# Altium schematic sheet MCU.SchDoc
size A2; SheetNumber: 3; SheetTotal: 9; SPICEModelCacheXJMQHWHR: <root> / <DocumentId>XJMQHWHR</DocumentId> / </root>
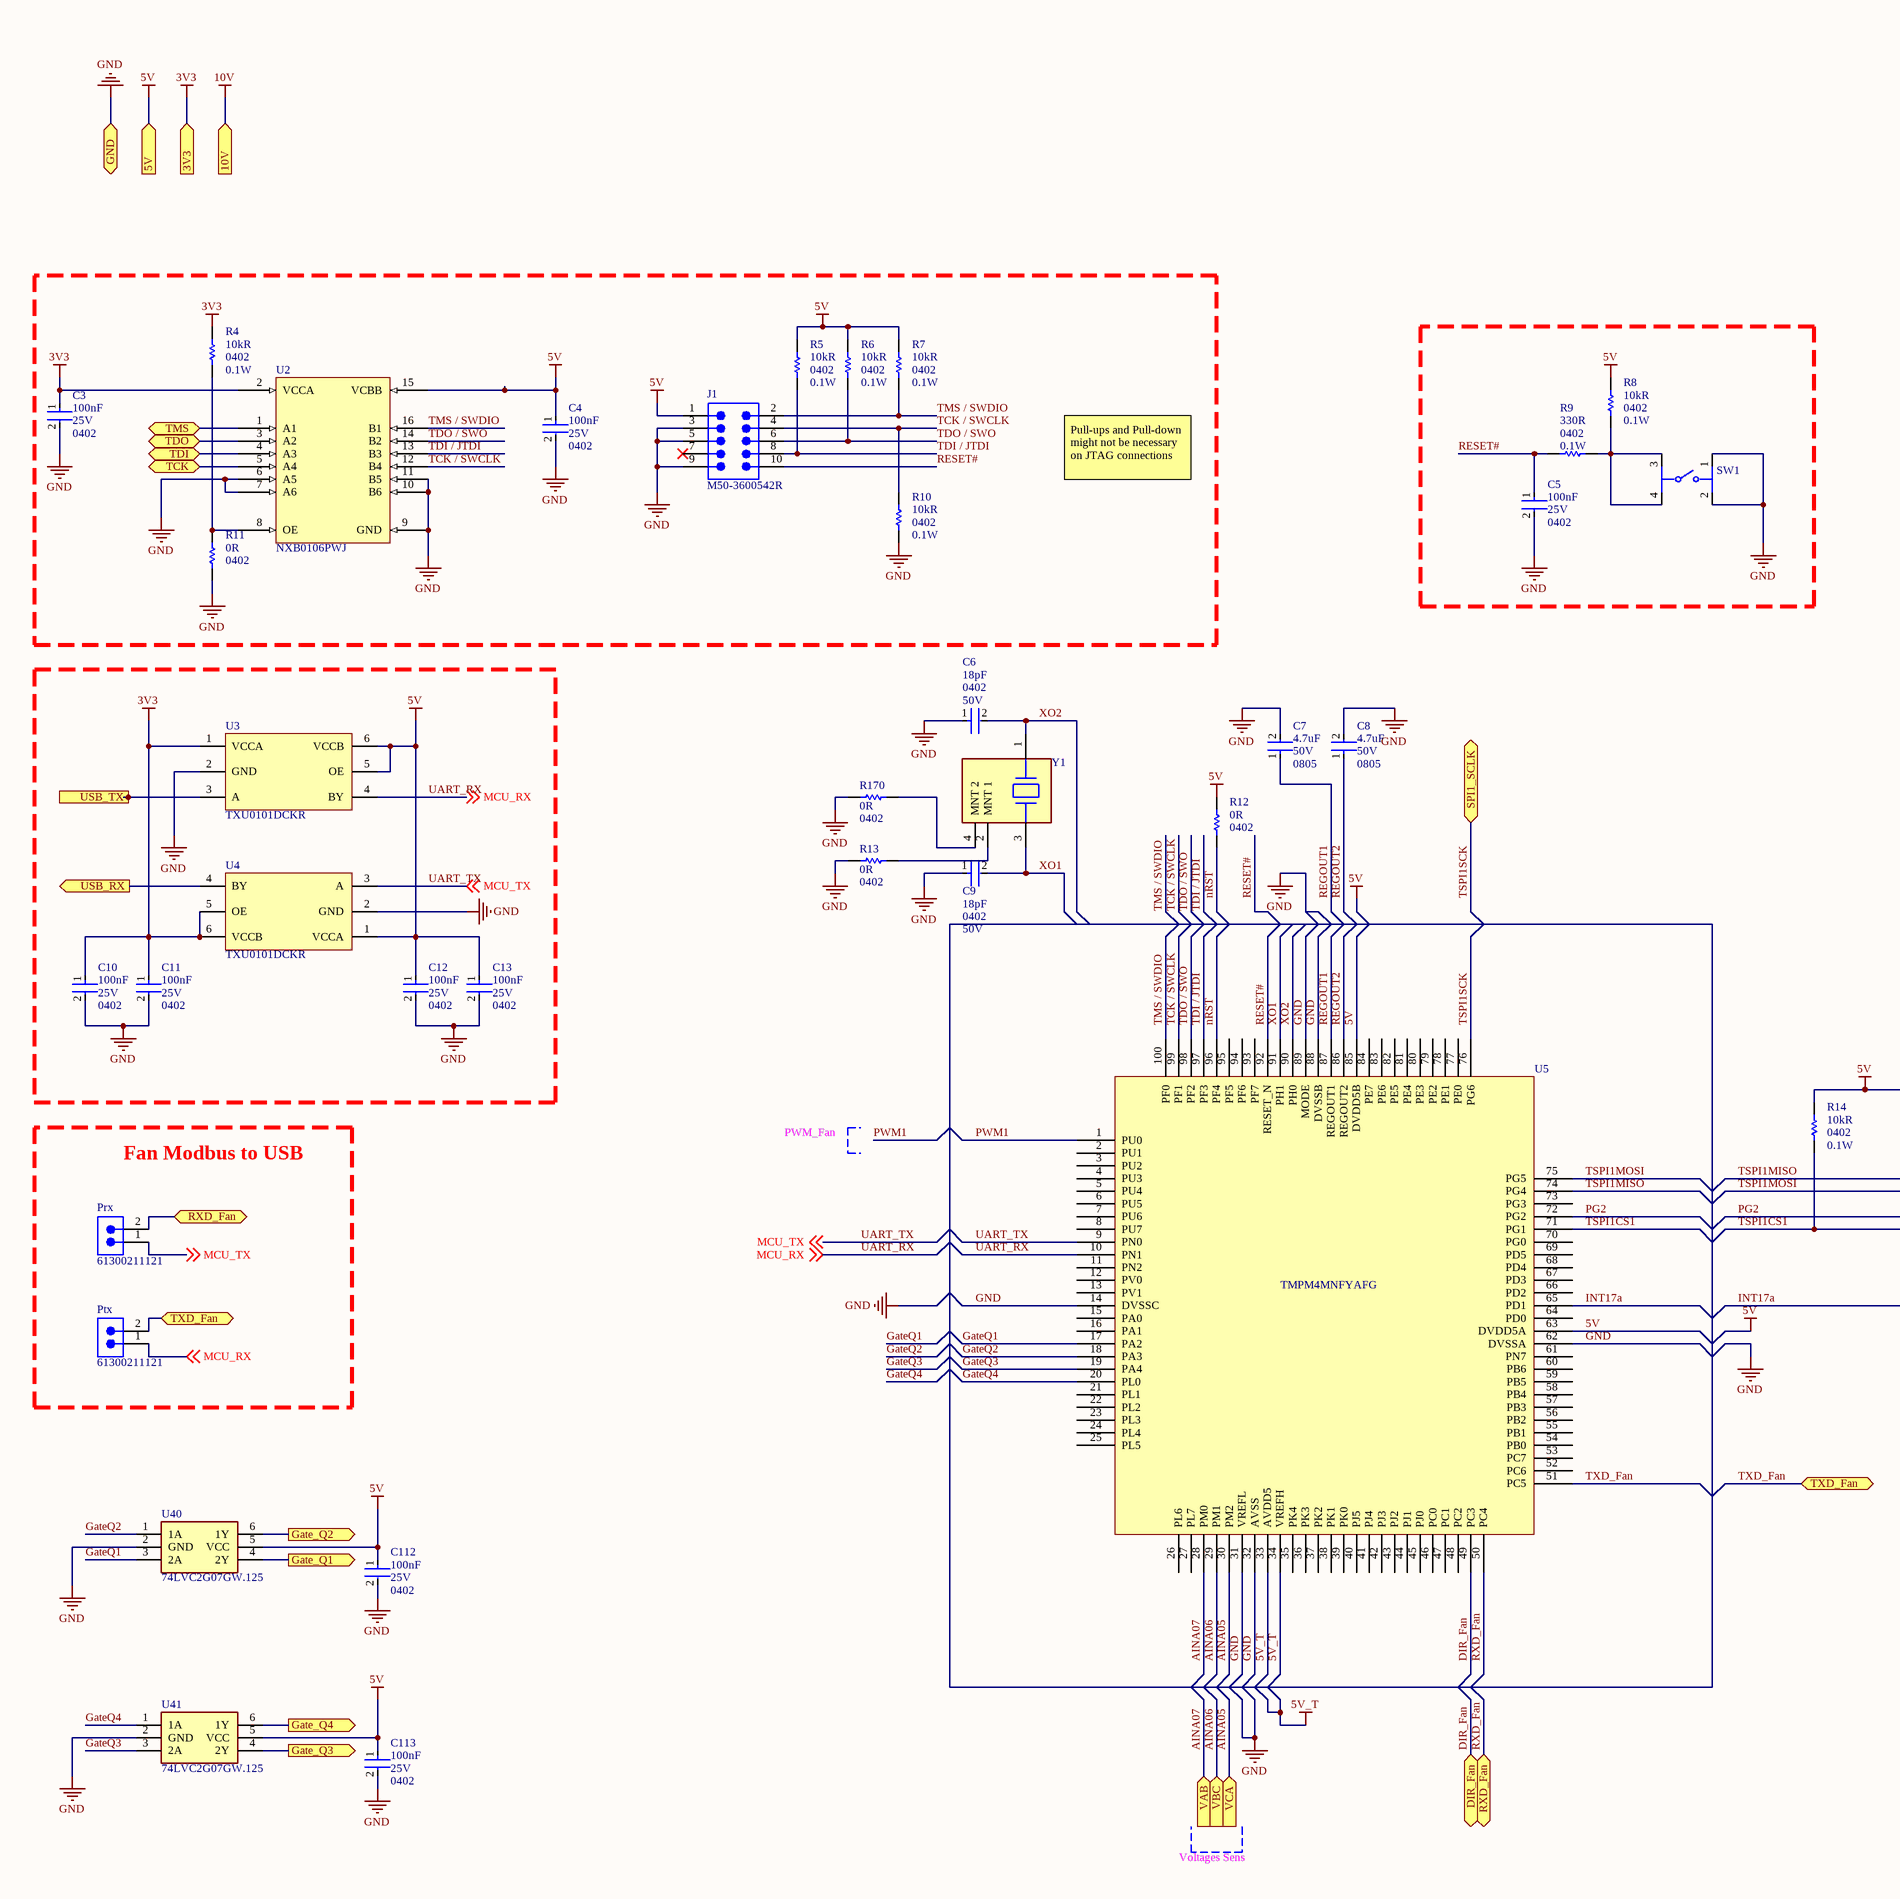
[diagram p0: MCU.SchDoc, left]
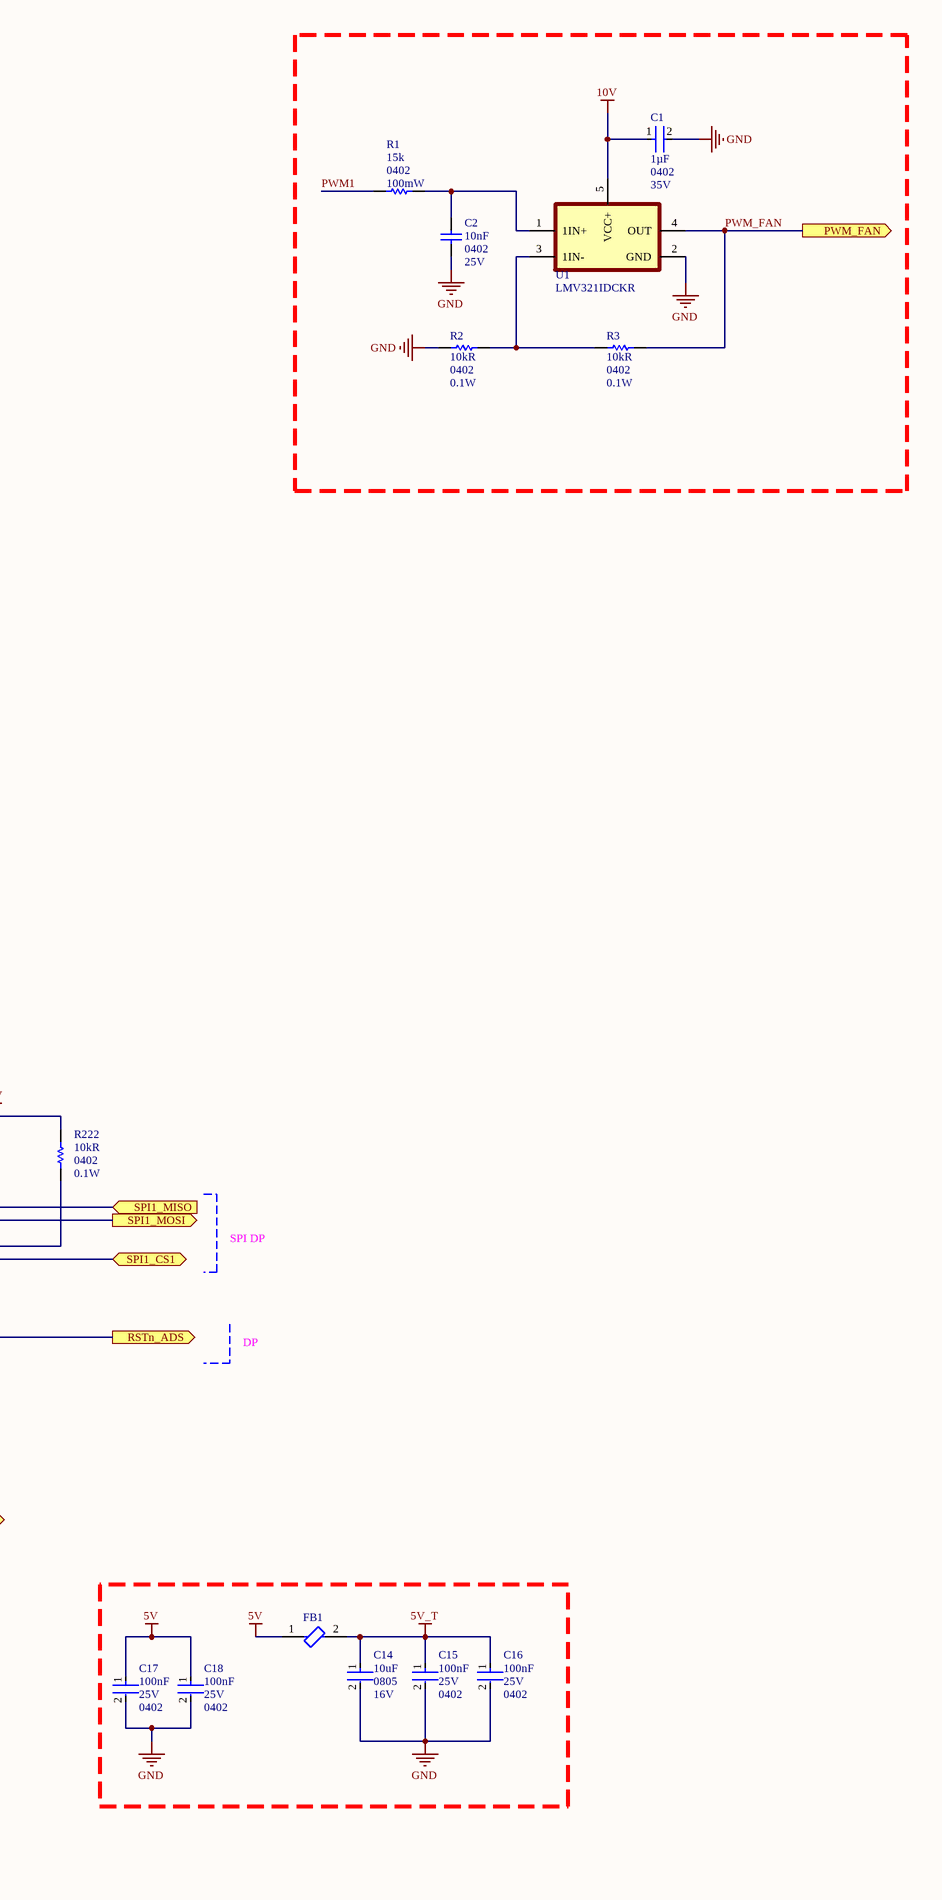
[diagram p1: MCU.SchDoc, right]

## Parts
C1  value 1µF  Case/Package: 0402  Voltage Rating: 35V  [FP-C1005-050-0_05-IPC_A]  (hidden comment: C1005JB1V105K050BC)
C2  value 10nF  Package: 0402  Parameter 1: 25V  [CAPC1005X55X25ML05T10]  (hidden comment: GRM155R71E103KA01D)
C3  value 100nF  Voltage Rating: 25V  Case/Package: 0402  [FP-CL830-IPC_A]  (hidden comment: CL05B104KA5NNNC)
C4  value 100nF  Voltage Rating: 25V  Case/Package: 0402  [FP-CL830-IPC_A]  (hidden comment: CL05B104KA5NNNC)
C5  value 100nF  Voltage Rating: 25V  Case/Package: 0402  [FP-CL830-IPC_A]  (hidden comment: CL05B104KA5NNNC)
C6  value 18pF  Case/Package: 0402  Voltage Rating: 50V  [FP-GJM155-0_05-IPC_A]  (hidden comment: GJM1555C1H180GB01D)
C7  Case/Package: 0805  Capacitance: 4.7uF  Voltage Rating: 50V  [FP-GRM21B-0_15-IPC_B]  (hidden comment: GRM21BR61H475KE51L)
C8  Case/Package: 0805  Capacitance: 4.7uF  Voltage Rating: 50V  [FP-GRM21B-0_15-IPC_B]  (hidden comment: GRM21BR61H475KE51L)
C9  value 18pF  Case/Package: 0402  Voltage Rating: 50V  [FP-GJM155-0_05-IPC_A]  (hidden comment: GJM1555C1H180GB01D)
C10  value 100nF  Voltage Rating: 25V  Case/Package: 0402  [FP-CL830-IPC_A]  (hidden comment: CL05B104KA5NNNC)
C11  value 100nF  Voltage Rating: 25V  Case/Package: 0402  [FP-CL830-IPC_A]  (hidden comment: CL05B104KA5NNNC)
C12  value 100nF  Voltage Rating: 25V  Case/Package: 0402  [FP-CL830-IPC_A]  (hidden comment: CL05B104KA5NNNC)
C13  value 100nF  Voltage Rating: 25V  Case/Package: 0402  [FP-CL830-IPC_A]  (hidden comment: CL05B104KA5NNNC)
C14  Case Code (Imperial): 0805  Voltage Rating: 16V  Capacitance: 10uF  [FP-GRM21B-0_1-MFG]  (hidden comment: GRM21BR61C106KE15K)
C15  value 100nF  Voltage Rating: 25V  Case/Package: 0402  [FP-CL830-IPC_A]  (hidden comment: CL05B104KA5NNNC)
C16  value 100nF  Voltage Rating: 25V  Case/Package: 0402  [FP-CL830-IPC_A]  (hidden comment: CL05B104KA5NNNC)
C17  value 100nF  Voltage Rating: 25V  Case/Package: 0402  [FP-CL830-IPC_A]  (hidden comment: CL05B104KA5NNNC)
C18  value 100nF  Voltage Rating: 25V  Case/Package: 0402  [FP-CL830-IPC_A]  (hidden comment: CL05B104KA5NNNC)
C112  value 100nF  Voltage Rating: 25V  Case/Package: 0402  [FP-CL830-IPC_A]  (hidden comment: CL05B104KA5NNNC)
C113  value 100nF  Voltage Rating: 25V  Case/Package: 0402  [FP-CL830-IPC_A]  (hidden comment: CL05B104KA5NNNC)
FB1  MPZ2012S221AT000  [FP-MPZ2012-MFG]  (value not drawn)
J1  M50-3600542R  [FP-M50-3600542R-MFG]
Prx  61300211121  [61300211121]
Ptx  61300211121  [61300211121]
R1  value 15k  Case/Package: 0402  Power: 100mW  [RESC1005X40X25LL10T10]  (hidden comment: RK73H1ETTP1502F)
R2  value 10kR  Package: 0402  Power: 0.1W  [RESC1005X40X25LL10T10]  (hidden comment: RK73H1ETTP1002F)
R3  value 10kR  Package: 0402  Power: 0.1W  [RESC1005X40X25LL10T10]  (hidden comment: RK73H1ETTP1002F)
R4  value 10kR  Package: 0402  Power Rating: 0.1W  [RESC1005X40X25LL10T10]  (hidden comment: RK73H1ETTP1002F)
R5  value 10kR  Package: 0402  Power Rating: 0.1W  [RESC1005X40X25LL10T10]  (hidden comment: RK73H1ETTP1002F)
R6  value 10kR  Package: 0402  Power Rating: 0.1W  [RESC1005X40X25LL10T10]  (hidden comment: RK73H1ETTP1002F)
R7  value 10kR  Package: 0402  Power Rating: 0.1W  [RESC1005X40X25LL10T10]  (hidden comment: RK73H1ETTP1002F)
R8  value 10kR  Package: 0402  Power Rating: 0.1W  [RESC1005X40X25LL10T10]  (hidden comment: RK73H1ETTP1002F)
R9  value 330R  Package: 0402  Power Rating: 0.1W  [RESC1005X40X25LL10T10]  (hidden comment: RK73H1ETTP3300F)
R10  value 10kR  Package: 0402  Power Rating: 0.1W  [RESC1005X40X25LL10T10]  (hidden comment: RK73H1ETTP1002F)
R11  value 0R  Package: 0402  [FP-RK73Z1E-IPC_B]  (hidden comment: RK73Z1ETTP)
R12  value 0R  Package: 0402  [FP-RK73Z1E-IPC_B]  (hidden comment: RK73Z1ETTP)
R13  value 0R  Package: 0402  [FP-RK73Z1E-IPC_B]  (hidden comment: RK73Z1ETTP)
R14  value 10kR  Package: 0402  Power Rating: 0.1W  [RESC1005X40X25LL10T10]  (hidden comment: RK73H1ETTP1002F)
R170  value 0R  Package: 0402  [FP-RK73Z1E-IPC_B]  (hidden comment: RK73Z1ETTP)
R222  value 10kR  Package: 0402  Power Rating: 0.1W  [RESC1005X40X25LL10T10]  (hidden comment: RK73H1ETTP1002F)
SW1  PTS810SJM250SMTRLFS  [FP-PTS810SJM250SMTRLFS-MFG]  (value not drawn)
U1  LMV321IDCKR  [LMV321IDCKR-Footprint-1]
U2  NXB0106PWJ  [TSOP65P640X120-16N]
U3  TXU0101DCKR  [FP-DCK0006A-MFG]
U4  TXU0101DCKR  [FP-DCK0006A-MFG]
U5  TMPM4MNFYAFG  [TSQFP50P1600X1600X145-100N]  (value not drawn)
U40  74LVC2G07GW.125  [74LVC2G07GW.125-Footprint-1]
U41  74LVC2G07GW.125  [74LVC2G07GW.125-Footprint-1]
Y1  ABM10-166-12.000MHZ-T3  [FP-ABM10-166-167-MFG]  (value not drawn)

## Blocks framed on the sheet
Fan Modbus to USB: Prx Ptx

## Ports
3V3 (in), 5V (in), 10V (in), DIR_Fan (bidir), Gate_Q1 (out), Gate_Q2 (out), Gate_Q3 (out), Gate_Q4 (out), GND (bidir), PWM_FAN (out), RSTn_ADS (out), RXD_Fan (bidir), SPI1_CS1 (bidir), SPI1_MISO (in), SPI1_MOSI (out), SPI1_SCLK (bidir), TCK (bidir), TDI (bidir), TDO (bidir), TMS (bidir), TXD_Fan (bidir), USB_RX (out), USB_TX (in), VAB (in), VBC (in), VCA (in)

## Nets
3V3: C3.1 C10.1 C11.1 R4.2 U2.2(VCCA) U3.1(VCCA) U4.5(OE) U4.6(VCCB) ; port 3V3
5V: C4.1 C12.1 C13.1 C17.1 C18.1 C112.1 C113.1 FB1.1 J1.1 R5.2 R6.2 R7.2 R8.2 R12.2 R14.2 R222.2 U2.15(VCBB) U3.5(OE) U3.6(VCCB) U4.1(VCCA) U5.63(DVDD5A) U5.85(DVDD5B) U40.5(VCC) U41.5(VCC) ; port 5V
5V_T: C14.1 C15.1 C16.1 FB1.2 U5.33(AVDD5) U5.34(VREFH)
10V: C1.1 U1.5(VCC+) ; port 10V
GND: C1.2 C2.1 C3.2 C4.2 C5.2 C6.1 C7.2 C8.2 C9.1 C10.2 C11.2 C12.2 C13.2 C14.2 C15.2 C16.2 C17.2 C18.2 C112.2 C113.2 J1.3 J1.5 J1.9 R2.1 R10.1 R11.1 R13.2 R170.2 SW1.1 SW1.2 U1.2(GND) U2.6(A5) U2.7(A6) U2.9(GND) U2.10(B6) U2.11(B5) U3.2(GND) U4.2(GND) U5.14(DVSSC) U5.31(VREFL) U5.32(AVSS) U5.62(DVSSA) U5.88(DVSSB) U5.89(MODE) U40.2(GND) U41.2(GND) ; port GND
AINA05: U5.30(PM2) ; port VCA
AINA06: U5.29(PM1) ; port VBC
AINA07: U5.28(PM0) ; port VAB
DIR_Fan: U5.49(PC3) ; port DIR_Fan
Gate_Q1: U40.4(2Y) ; port Gate_Q1
Gate_Q2: U40.6(1Y) ; port Gate_Q2
Gate_Q3: U41.4(2Y) ; port Gate_Q3
Gate_Q4: U41.6(1Y) ; port Gate_Q4
GateQ1: U5.17(PA2) U40.3(2A)
GateQ2: U5.18(PA3) U40.1(1A)
GateQ3: U5.19(PA4) U41.3(2A)
GateQ4: U5.20(PL0) U41.1(1A)
INT17a: U5.65(PD1) ; port RSTn_ADS
nRST: R12.1 U5.96(PF4)
PG2: R222.1 U5.72(PG2)
PWM1: R1.1 U5.1(PU0)
PWM_FAN: R3.2 U1.4(OUT) ; port PWM_FAN
REGOUT1: C7.1 U5.87(REGOUT1)
REGOUT2: C8.1 U5.86(REGOUT2)
RESET#: C5.1 J1.10 R9.1 U5.92(RESET_N)
RXD_Fan: Prx.2 U5.50(PC4) ; port RXD_Fan
TCK: U2.5(A4) ; port TCK
TCK / SWCLK: J1.4 R10.2 U2.12(B4) U5.99(PF1)
TDI: U2.4(A3) ; port TDI
TDI / JTDI: J1.8 R5.1 U2.13(B3) U5.97(PF3)
TDO: U2.3(A2) ; port TDO
TDO / SWO: J1.6 R6.1 U2.14(B2) U5.98(PF2)
TMS: U2.1(A1) ; port TMS
TMS / SWDIO: J1.2 R7.1 U2.16(B1) U5.100(PF0)
TSPI1CS1: R14.1 U5.71(PG1) ; port SPI1_CS1
TSPI1MISO: U5.74(PG4) ; port SPI1_MISO
TSPI1MOSI: U5.75(PG5) ; port SPI1_MOSI
TSPI1SCK: U5.76(PG6) ; port SPI1_SCLK
TXD_Fan: Ptx.2 U5.51(PC5) ; port TXD_Fan
UART_RX: Ptx.1 U3.4(BY) U5.10(PN1) ; off-sheet MCU_RX  [also labelled MCU_RX]
UART_TX: Prx.1 U4.3(A) U5.9(PN0) ; off-sheet MCU_TX  [also labelled MCU_TX]
USB_RX: U4.4(BY) ; port USB_RX
USB_TX: U3.3(A) ; port USB_TX
XO1: C9.2 U5.91(PH1) Y1.3
XO2: C6.2 U5.90(PH0) Y1.1
NetC2_2: C2.2 R1.2 U1.1(1IN+)
NetR2_2: R2.2 R3.1 U1.3(1IN-)
NetR4_1: R4.1 R11.2 U2.8(OE)
NetR8_1: R8.1 R9.2 SW1.3 SW1.4
NetR13_1: R13.1 Y1.2(MNT_1)
NetR170_1: R170.1 Y1.4(MNT_2)

Not connected (* = marked no-connect by the designer): J1 7*; U5 2(PU1) 3(PU2) 4(PU3) 5(PU4) 6(PU5) 7(PU6) 8(PU7) 11(PN2) 12(PV0) 13(PV1) 15(PA0) 16(PA1) 21(PL1) 22(PL2) 23(PL3) 24(PL4) 25(PL5) 26(PL6) 27(PL7) 35(PK4) 36(PK3) 37(PK2) 38(PK1) 39(PK0) 40(PJ5) 41(PJ4) 42(PJ3) 43(PJ2) 44(PJ1) 45(PJ0) 46(PC0) 47(PC1) 48(PC2) 52(PC6) 53(PC7) 54(PB0) 55(PB1) 56(PB2) 57(PB3) 58(PB4) 59(PB5) 60(PB6) 61(PN7) 64(PD0) 66(PD2) 67(PD3) 68(PD4) 69(PD5) 70(PG0) 73(PG3) 77(PE0) 78(PE1) 79(PE2) 80(PE3) 81(PE4) 82(PE5) 83(PE6) 84(PE7) 93(PF7) 94(PF6) 95(PF5)

## Notes on the sheet
- Pull-ups and Pull-down might not be necessary on JTAG connections
- PWM_Fan
- SPI DP
- DP
- Voltages Sens
- Title:
- Date:
- Drawn By:
- File:
- Time:
- Checked By:
- Sheet
- of

## Library data of the parts
C1 = CMP-001-00329-1: Ceramic Capacitor, Multilayer, Ceramic, 35V, 10% +Tol, 10% -Tol, JB, 10% TC, 1uF, Surface Mount, 0402; Capacitor Type: Ceramic; Min Operating Temperature: -25°C; RoHS Compliant: Yes; Max Operating Temperature: 85°C; Pins: 2; Mounting Technology: Surface Mount
C2 = CMP-x00072-1: Ceramic Capacitor, Multilayer, Ceramic, 25V, 10% +Tol, 10% -Tol, X7R, 15% TC, 0.01uF, Surface Mount, 0402; Manufacturer: Murata; Template: MR_0402; Vendor: TTI; Reel Width: 8mm; Mounting: SMT; MOQ: 10000; Category: Capacitor; Price: 0.00352
C3-C5 C10-C13 C15-C18 C112 C113 = CMP-001-00333-1: Ceramic Capacitor, Multilayer, Ceramic, 25V, 10% +Tol, 10% -Tol, X7R, 15% TC, 0.1uF, Surface Mount, 0402; Max Operating Temperature: 125°C; RoHS Compliant: Yes; Capacitor Type: Ceramic; Min Operating Temperature: -55°C; Pins: 2; Mounting Technology: Surface Mount
C6 C9 = CMP-001-00347-1: Ceramic Capacitor, Multilayer, Ceramic, 50V, 2% +Tol, 2% -Tol, C0G, 30ppm/Cel TC, 0.000018uF, Surface Mount, 0402; Max Operating Temperature: 125°C; RoHS Compliant: Yes; Pins: 2; Capacitor Type: Ceramic; Min Operating Temperature: -55°C; Mounting Technology: Surface Mount
C7 C8 = CMP-06035-059131-1: Chip Multilayer Ceramic Capacitors for General Purpose, 0805, 4.7uF, X5R, 15%, 10%, 50V; Case Code (Metric): 2012; Height: 1.25mm; Width: 0.049inch; Packaging: Tape and Reel; Mount: Surface Mount; REACH SVHC: No SVHC; Case Code (Imperial): 0805; Dielectric: X5R; Thickness: 0.055inch; Material: Ceramic; Depth: 1.25mm; Min Operating Temperature: -55°C; Lead Free: Lead Free; Max Operating Temperature: 85°C; Tolerance: 10%; Length: 2mm; Voltage Rating (DC): 50V
C14 = CMP-2007-03534-2: Chip Multilayer Ceramic Capacitors for General Purpose, 0805, 10uF, X5R, 15%, 10%, 16V; Packaging: Tape and Reel; Width: 0.049inch; Depth: 1.25mm; Height: 1.25mm; Case/Package: 0805; Max Operating Temperature: 85°C; Min Operating Temperature: -55°C; Tolerance: 10%; Dielectric: X5R; REACH SVHC: No SVHC; Mount: Surface Mount; Radiation Hardening: No; Case Code (Metric): 2012; Length: 2mm; Package Quantity: 10000; Voltage Rating (DC): 16V; Voltage: 16V; Thickness: 0.053inch; Termination: SMD/SMT
FB1 = CMP-08257-000020-1: FERRITE BEAD 220 OHM 0805 1LN; Test Frequency: 100MHz; Max DC Current: 3A; Tolerance: 25%; Impedance: 220R; DC Resistance (DCR): 40mR; Case/Package: 0805; Mount: Surface Mount; Termination: SMD/SMT; Packaging: Tape and Reel; Core Material: Ferrite; Case Code (Metric): 2012; Length: 0.079inch; Width: 0.049inch; Case Code (Imperial): 0805; REACH SVHC: No SVHC; Weight: 0.000194oz; Current Rating: 3A; Min Operating Temperature: -55°C; Lead Free: Lead Free; Package Quantity: 4000; Max Operating Temperature: 125°C; RoHS Compliant: Yes; Depth: 1.25mm; Height: 0.85mm
J1 = CMP-002-00657-2: Board Connector, 10 Contact(s), 2 Row(s), Female, Straight, 0.05 inch Pitch, Surface Mount Terminal, Locking, Black Insulator, Socket; Rating: 1A; Vendor: TTI; Reel Size: 16mm; MOQ: 800; Price Floor Quantity: 8000; Max Operating Temperature: 105°C; Mounting: SMT; Min Operating Temperature: -40°C; Source: Components - 07.02.25 - 13.24.SchLib; Mounting Technology: Board; Connector Type: BOARD CONNECTOR; RoHS Compliant: Yes; Price Floor: 0.75; Design Item ID: CMP-00130-1; Price @ MOQ: 0.86; Category: Connector; Case/Package: [5 x 2] 1.27mm
Prx Ptx = CMP-002-00257-1: WR-PHD Pin Header, THT, Vertical, pitch 2.54mm, 1 Row, 2P; Manufacturer: Wurth Elektronik; Contact Resistance: 20mOhm; Working Voltage: 250V; Rated Current: 3A; Withstanding Voltage: 500V; Match Code: WR-PHD; Packaging: Bag; ComponentLink2Description: Datasheet Link; Source: WR-PHD.SchLib; Operating Temperature Max: 105°C; Pin Count: 2; Orientation: Vertical; Gender: Pin Header; Pitch: 2.54mm; Manufacturer Part Number: 61300211121; Mount: Through Hole; ComponentLink1Description: Website Link; ComponentLink2URL: https://www.we-online.com/redexpert/spec/61300211121?ad; Pins: 2; ComponentLink1URL: https://www.we-online.com/redexpert/article/61300211121?ad; Design Item ID: 61300211121; Category: Board-to-Board Connectors; Number of Rows: 1; Component Type: Standard; Operating Temperature Min: -40°C
R1 = CMP-009-01023-1: Fixed Resistor, Metal Glaze/thick Film, 0.1W, 15000ohm, 75V, 1% +/-Tol, 100ppm/Cel, Surface Mount, 0402; Max Operating Temperature: 155°C; Tolerance: 1%; Min Operating Temperature: -55°C; Pins: 2; RoHS Compliant: Yes; Mounting Technology: Surface Mount
R2-R8 R10 R14 R222 = CMP-x00150-2: Fixed Resistor, Metal Glaze/thick Film, 0.1W, 10000ohm, 75V, 1% +/-Tol, 100ppm/Cel, Surface Mount, 0402; Template: KS_0402_R
R9 = CMP-x00168-1: Fixed Resistor, Metal Glaze/thick Film, 0.1W, 330ohm, 75V, 1% +/-Tol, 100ppm/Cel, Surface Mount, 0402
R11-R13 R170 = CMP-x00147-2: Metal Glaze/thick Film, 0ohm, Surface Mount, 0402; Template: KS_0402_R
  R11 R12: Power Rating: *
SW1 = CMP-x00082-1: Keypad Switch, 1 Switches, SPST, Momentary-tactile, 0.05A, 16VDC, 1.57N, Solder Terminal, Surface Mount-straight; Manufacturer: C&K; Reel Width: 12mm; Vendor: TTI; Category: Switches; MOQ: 2900; Mounting: SMT; Package: SPST; Price: 0.233; Template: -; Value: -
U1 = CMP-014-00033-1: Operational Amplifier, 1 Func, 7000uV Offset-Max, BIPolar, PDSO5; Channels: 1; Nominal Supply Voltage: 2.7V; Pins: 5; RoHS Compliant: Yes; Min Operating Temperature: -40°C; Case/Package: TSSOP; Max Operating Temperature: 125°C
U2 = CMP-x00220-1: NXB0106 - Dual supply translating transceiver; auto direction sensing; 3-state
U3 U4 = CMP-x00221-3: Single channel fixed-direction level shifter 6-SC70 -40 to 125
U5 = CMP-001-0044-8: Toshiba Micro
U40 U41 = CMP-00122-1: Buffer, Non-Inverting 2 Element 1 Bit per Element Open Drain Output 6-TSSOP
Y1 = CMP-003-00032-4: Crystal 12MHz ±10ppm (Tol) ±10ppm (Stability) 8pF FUND 125Ohm 4-Pin SMD T/R; Manufacturer: TI; Vendor: TTI; Reel Size: 8mm; Template: TI_4_SMD; Category: Crystal; Price: 0.207; Rating: 8pF; MOQ: 3000; Value: 12MHz; Package: 4-SMD; Mounting Technology: SMT